# EasyEDA schematic Sheet_3.json
TITLE: 8 Bit ALU - Q XOR M; REV: 1.0; Date: 2021-12-30; Sheet: 3/3; Drawn By: Koehler, Paul; Company: komed3
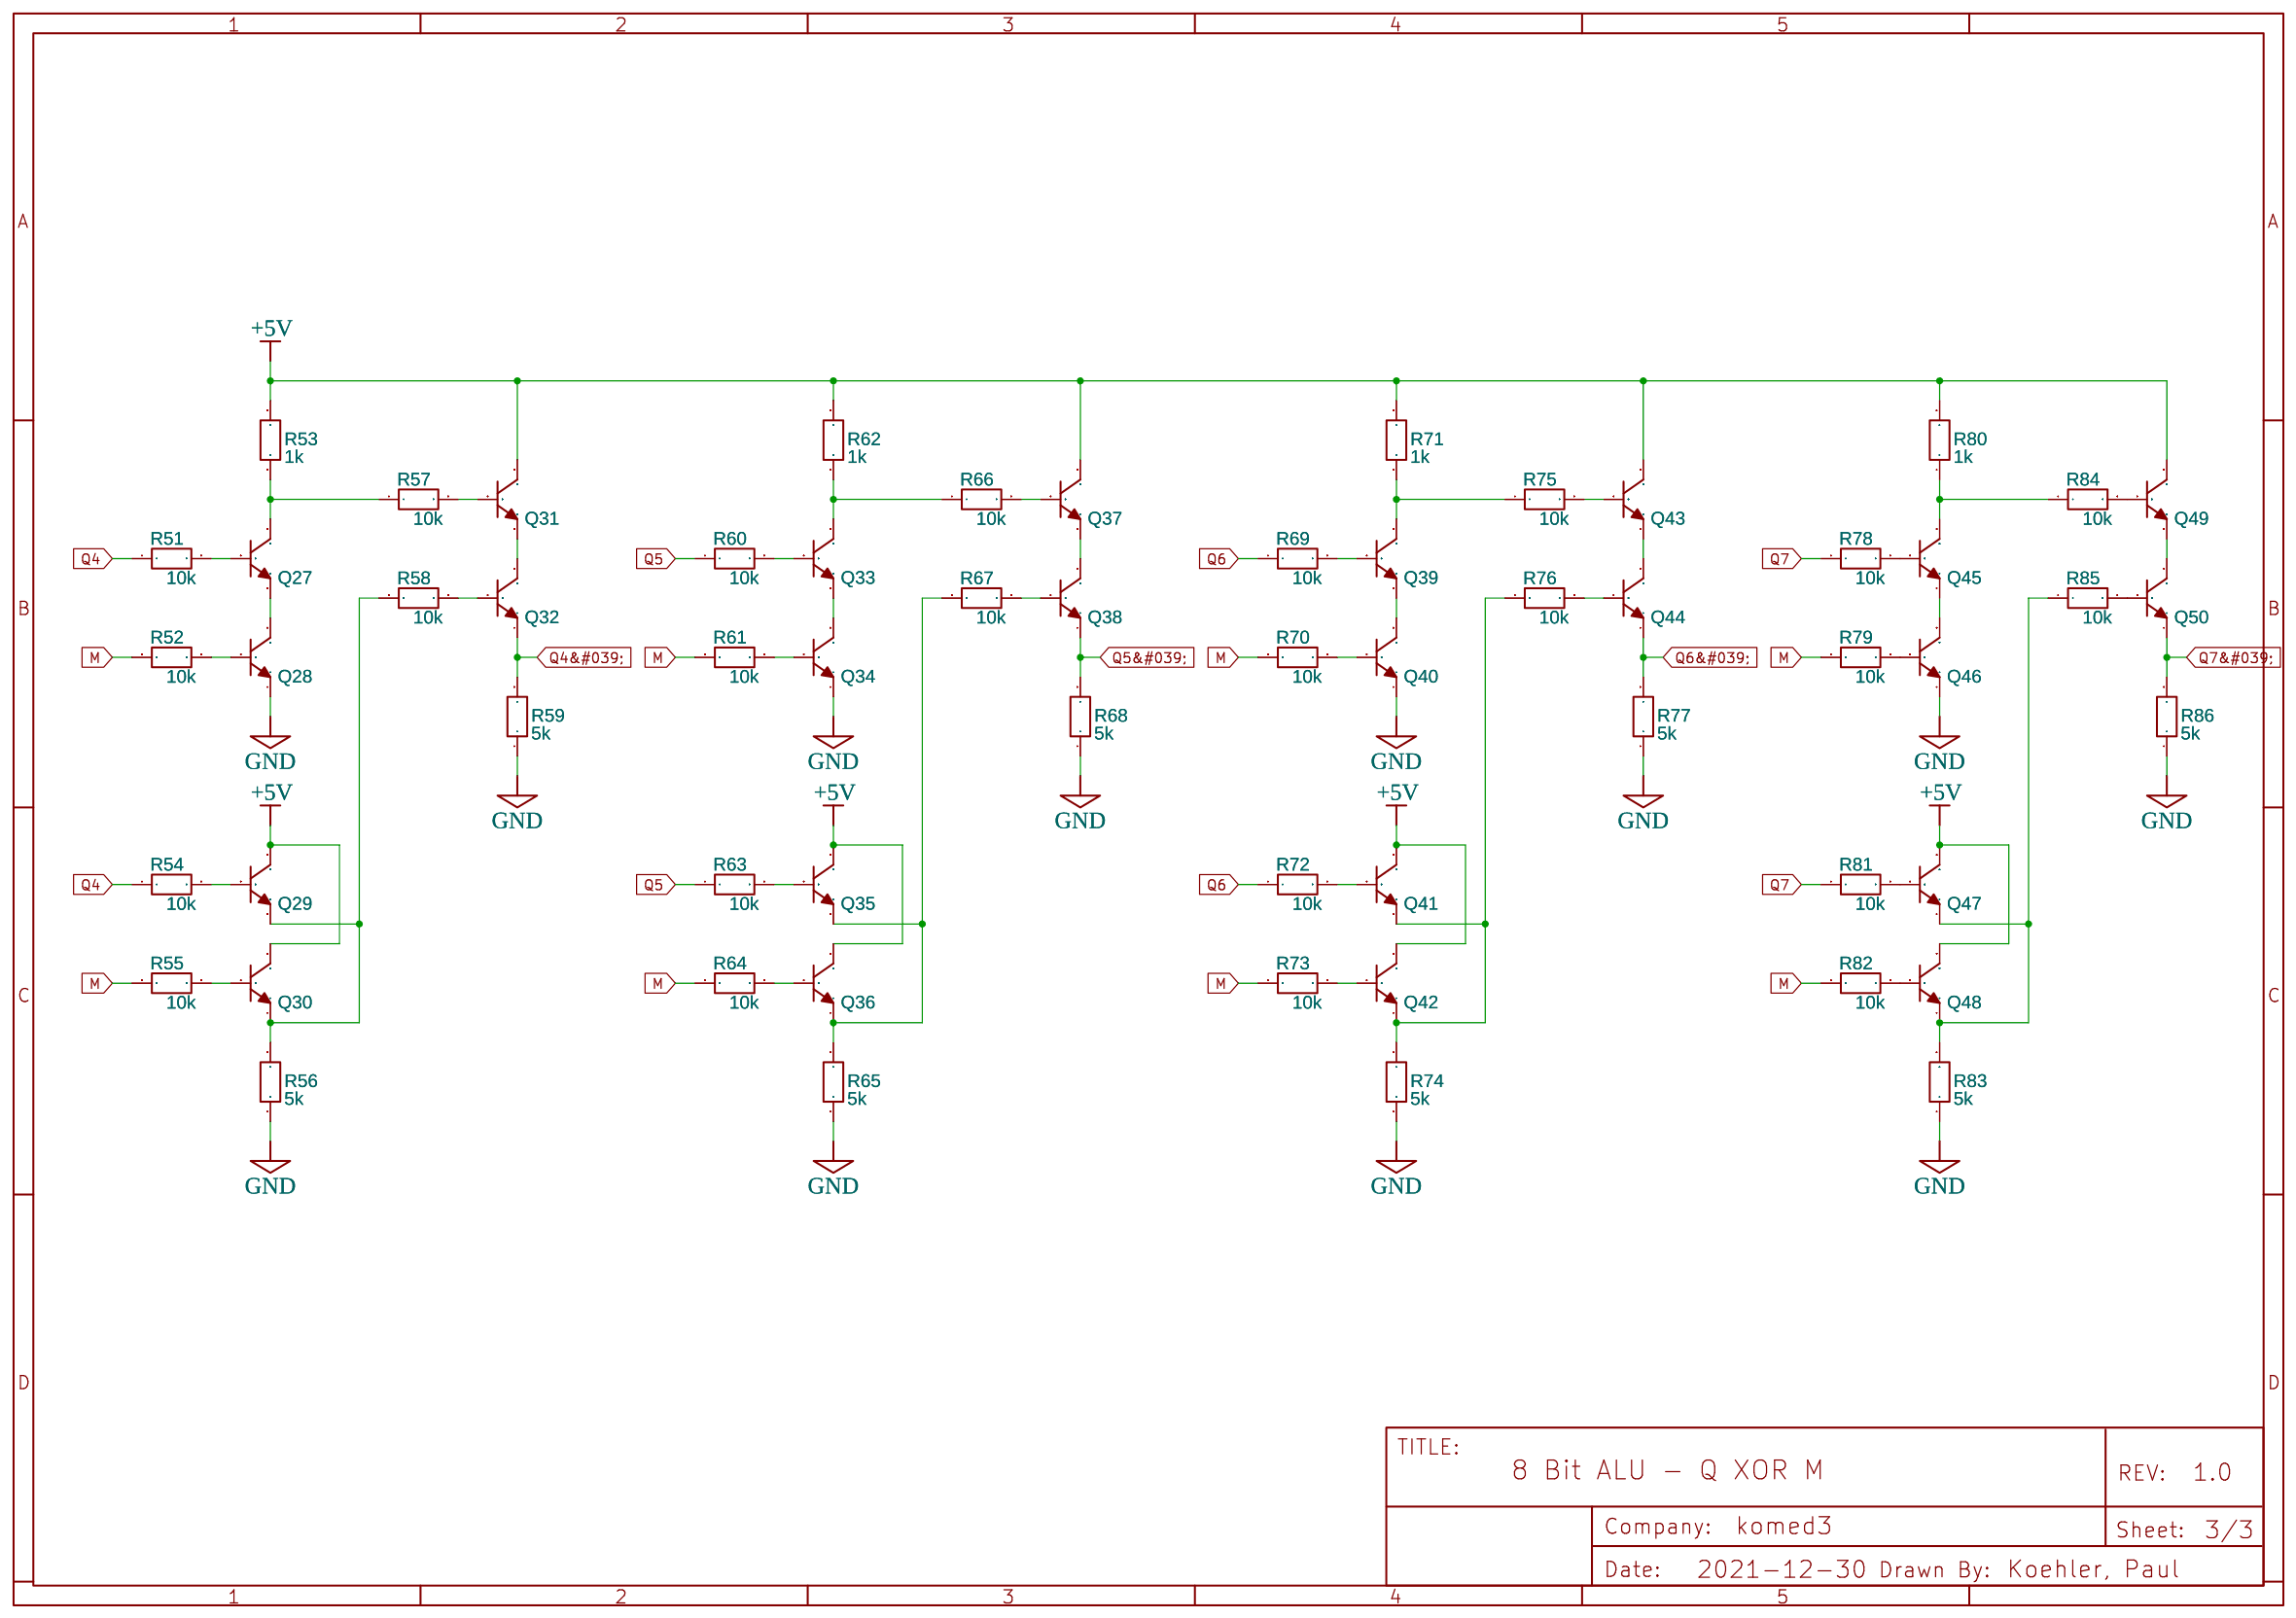
[diagram p0: schematic sheet]

## Parts
Q27  2N3904(TO-92)  [TO-92-3_L5.1-W4.1-P1.27-L]
Q28  2N3904(TO-92)  [TO-92-3_L5.1-W4.1-P1.27-L]
Q29  2N3904(TO-92)  [TO-92-3_L5.1-W4.1-P1.27-L]
Q30  2N3904(TO-92)  [TO-92-3_L5.1-W4.1-P1.27-L]
Q31  2N3904(TO-92)  [TO-92-3_L5.1-W4.1-P1.27-L]
Q32  2N3904(TO-92)  [TO-92-3_L5.1-W4.1-P1.27-L]
Q33  2N3904(TO-92)  [TO-92-3_L5.1-W4.1-P1.27-L]
Q34  2N3904(TO-92)  [TO-92-3_L5.1-W4.1-P1.27-L]
Q35  2N3904(TO-92)  [TO-92-3_L5.1-W4.1-P1.27-L]
Q36  2N3904(TO-92)  [TO-92-3_L5.1-W4.1-P1.27-L]
Q37  2N3904(TO-92)  [TO-92-3_L5.1-W4.1-P1.27-L]
Q38  2N3904(TO-92)  [TO-92-3_L5.1-W4.1-P1.27-L]
Q39  2N3904(TO-92)  [TO-92-3_L5.1-W4.1-P1.27-L]
Q40  2N3904(TO-92)  [TO-92-3_L5.1-W4.1-P1.27-L]
Q41  2N3904(TO-92)  [TO-92-3_L5.1-W4.1-P1.27-L]
Q42  2N3904(TO-92)  [TO-92-3_L5.1-W4.1-P1.27-L]
Q43  2N3904(TO-92)  [TO-92-3_L5.1-W4.1-P1.27-L]
Q44  2N3904(TO-92)  [TO-92-3_L5.1-W4.1-P1.27-L]
Q45  2N3904(TO-92)  [TO-92-3_L5.1-W4.1-P1.27-L]
Q46  2N3904(TO-92)  [TO-92-3_L5.1-W4.1-P1.27-L]
Q47  2N3904(TO-92)  [TO-92-3_L5.1-W4.1-P1.27-L]
Q48  2N3904(TO-92)  [TO-92-3_L5.1-W4.1-P1.27-L]
Q49  2N3904(TO-92)  [TO-92-3_L5.1-W4.1-P1.27-L]
Q50  2N3904(TO-92)  [TO-92-3_L5.1-W4.1-P1.27-L]
R51  10k  [RESISTOR-1/2W-VERTICAL]
R52  10k  [RESISTOR-1/2W-VERTICAL]
R53  1k  [RESISTOR-1/2W-VERTICAL]
R54  10k  [RESISTOR-1/2W-VERTICAL]
R55  10k  [RESISTOR-1/2W-VERTICAL]
R56  5k  [RESISTOR-1/2W-VERTICAL]
R57  10k  [RESISTOR-1/2W-VERTICAL]
R58  10k  [RESISTOR-1/2W-VERTICAL]
R59  5k  [RESISTOR-1/2W-VERTICAL]
R60  10k  [RESISTOR-1/2W-VERTICAL]
R61  10k  [RESISTOR-1/2W-VERTICAL]
R62  1k  [RESISTOR-1/2W-VERTICAL]
R63  10k  [RESISTOR-1/2W-VERTICAL]
R64  10k  [RESISTOR-1/2W-VERTICAL]
R65  5k  [RESISTOR-1/2W-VERTICAL]
R66  10k  [RESISTOR-1/2W-VERTICAL]
R67  10k  [RESISTOR-1/2W-VERTICAL]
R68  5k  [RESISTOR-1/2W-VERTICAL]
R69  10k  [RESISTOR-1/2W-VERTICAL]
R70  10k  [RESISTOR-1/2W-VERTICAL]
R71  1k  [RESISTOR-1/2W-VERTICAL]
R72  10k  [RESISTOR-1/2W-VERTICAL]
R73  10k  [RESISTOR-1/2W-VERTICAL]
R74  5k  [RESISTOR-1/2W-VERTICAL]
R75  10k  [RESISTOR-1/2W-VERTICAL]
R76  10k  [RESISTOR-1/2W-VERTICAL]
R77  5k  [RESISTOR-1/2W-VERTICAL]
R78  10k  [RESISTOR-1/2W-VERTICAL]
R79  10k  [RESISTOR-1/2W-VERTICAL]
R80  1k  [RESISTOR-1/2W-VERTICAL]
R81  10k  [RESISTOR-1/2W-VERTICAL]
R82  10k  [RESISTOR-1/2W-VERTICAL]
R83  5k  [RESISTOR-1/2W-VERTICAL]
R84  10k  [RESISTOR-1/2W-VERTICAL]
R85  10k  [RESISTOR-1/2W-VERTICAL]
R86  5k  [RESISTOR-1/2W-VERTICAL]

## Library data of the parts
Q27-Q50 = 2N3904(TO-92): Supplier: LCSC; Manufacturer: SEMTECH; Manufacturer Part: 2N3904; Supplier Part: C118538; Contributor: LCEDA_Lib
R51-R86 = R_AXIAL-0.3_EU: Contributor: LCEDA_Lib

## Nets
+5V: Q29.3(C) Q30.3(C) Q31.3(C) Q35.3(C) Q36.3(C) Q37.3(C) Q41.3(C) Q42.3(C) Q43.3(C) Q47.3(C) Q48.3(C) Q49.3(C) R53.2 R62.2 R71.2 R80.2
GND: Q28.1(E) Q34.1(E) Q40.1(E) Q46.1(E) R56.1 R59.1 R65.1 R68.1 R74.1 R77.1 R83.1 R86.1
M: R52.1 R55.1 R61.1 R64.1 R70.1 R73.1 R79.1 R82.1
Q4: R51.1 R54.1
Q4&#039;: Q32.1(E) R59.2
Q5: R60.1 R63.1
Q5&#039;: Q38.1(E) R68.2
Q6: R69.1 R72.1
Q6&#039;: Q44.1(E) R77.2
Q7: R78.1 R81.1
Q7&#039;: Q50.1(E) R86.2
Net-(Q27-1): Q27.1(E) Q28.3(C)
Net-(Q27-2): Q27.2(B) R51.2
Net-(Q27-3): Q27.3(C) R53.1 R57.1
Net-(Q28-2): Q28.2(B) R52.2
Net-(Q29-1): Q29.1(E) Q30.1(E) R56.2 R58.1
Net-(Q29-2): Q29.2(B) R54.2
Net-(Q30-2): Q30.2(B) R55.2
Net-(Q31-1): Q31.1(E) Q32.3(C)
Net-(Q31-2): Q31.2(B) R57.2
Net-(Q32-2): Q32.2(B) R58.2
Net-(Q33-1): Q33.1(E) Q34.3(C)
Net-(Q33-2): Q33.2(B) R60.2
Net-(Q33-3): Q33.3(C) R62.1 R66.1
Net-(Q34-2): Q34.2(B) R61.2
Net-(Q35-1): Q35.1(E) Q36.1(E) R65.2 R67.1
Net-(Q35-2): Q35.2(B) R63.2
Net-(Q36-2): Q36.2(B) R64.2
Net-(Q37-1): Q37.1(E) Q38.3(C)
Net-(Q37-2): Q37.2(B) R66.2
Net-(Q38-2): Q38.2(B) R67.2
Net-(Q39-1): Q39.1(E) Q40.3(C)
Net-(Q39-2): Q39.2(B) R69.2
Net-(Q39-3): Q39.3(C) R71.1 R75.1
Net-(Q40-2): Q40.2(B) R70.2
Net-(Q41-1): Q41.1(E) Q42.1(E) R74.2 R76.1
Net-(Q41-2): Q41.2(B) R72.2
Net-(Q42-2): Q42.2(B) R73.2
Net-(Q43-1): Q43.1(E) Q44.3(C)
Net-(Q43-2): Q43.2(B) R75.2
Net-(Q44-2): Q44.2(B) R76.2
Net-(Q45-1): Q45.1(E) Q46.3(C)
Net-(Q45-2): Q45.2(B) R78.2
Net-(Q45-3): Q45.3(C) R80.1 R84.1
Net-(Q46-2): Q46.2(B) R79.2
Net-(Q47-1): Q47.1(E) Q48.1(E) R83.2 R85.1
Net-(Q47-2): Q47.2(B) R81.2
Net-(Q48-2): Q48.2(B) R82.2
Net-(Q49-1): Q49.1(E) Q50.3(C)
Net-(Q49-2): Q49.2(B) R84.2
Net-(Q50-2): Q50.2(B) R85.2
